# EAGLE design Relay_PCB_v1 (EAGLE 9.0.1)
Relay1
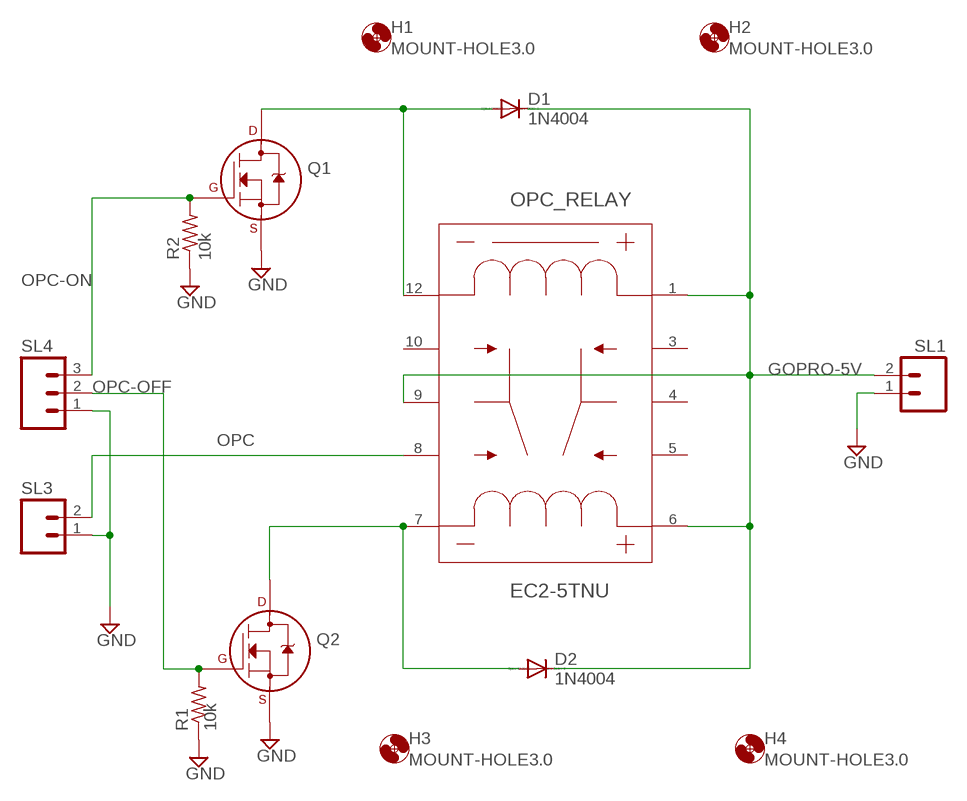
[diagram p0: schematic, sheet 1]

## Parts
D1  1N4004  [DO41-10]
D2  1N4004  [DO41-10]
H1  MOUNT-HOLE3.0  [3,0]
H2  MOUNT-HOLE3.0  [3,0]
H3  MOUNT-HOLE3.0  [3,0]
H4  MOUNT-HOLE3.0  [3,0]
OPC_RELAY  EC2-5TNU  [EC2TNU]
Q1  2N7000_TO92  [TO-92]
Q2  2N7000_TO92  [TO-92]
R1  R-US_0207/7  [0207/7]
R2  R-US_0207/7  [0207/7]
SL1  M02  [02P]
SL3  M02  [02P]
SL4  M03  [03P]

## Nets
GND: Q1.1(S) Q2.1(S) R1.1 R2.1 SL1.1 SL3.1 SL4.1
GOPRO-5V: D1.C D2.C OPC_RELAY.1 OPC_RELAY.6 OPC_RELAY.9 SL1.2
N$1: D1.A OPC_RELAY.12 Q1.3(D)
N$3: D2.A OPC_RELAY.7 Q2.3(D)
OPC: OPC_RELAY.8 SL3.2
OPC-OFF: Q2.2(G) R1.2 SL4.2
OPC-ON: Q1.2(G) R2.2 SL4.3
Unconnected: OPC_RELAY.3 OPC_RELAY.4 OPC_RELAY.5 OPC_RELAY.10

## Notes on the sheet
- 10k
- 10k

## Library data of the parts
D1 D2 = diode:1N4004: DIODE general purpose rectifier, 1 A
H1-H4 = holes:MOUNT-HOLE: MOUNTING HOLE with drill center marker
OPC_RELAY = EC2-5TNU:EC2-5TNU; MANUFACTURER_PART_NUMBER: EC25TNU; VENDOR: KEMET
Q1 Q2 = transistors:2N700*: 2N7000, 2N7002, NDS7002A N-channel enhancement mode MOSFET
R1 R2 = rcl:R-US_: RESISTOR, American symbol; SPICEPREFIX: R
SL1 SL3 = con-amp-quick:M02: AMP QUICK CONNECTOR; OC_FARNELL: unknown; OC_NEWARK: unknown
SL4 = con-amp-quick:M03: AMP QUICK CONNECTOR; OC_FARNELL: unknown; OC_NEWARK: unknown

## Board
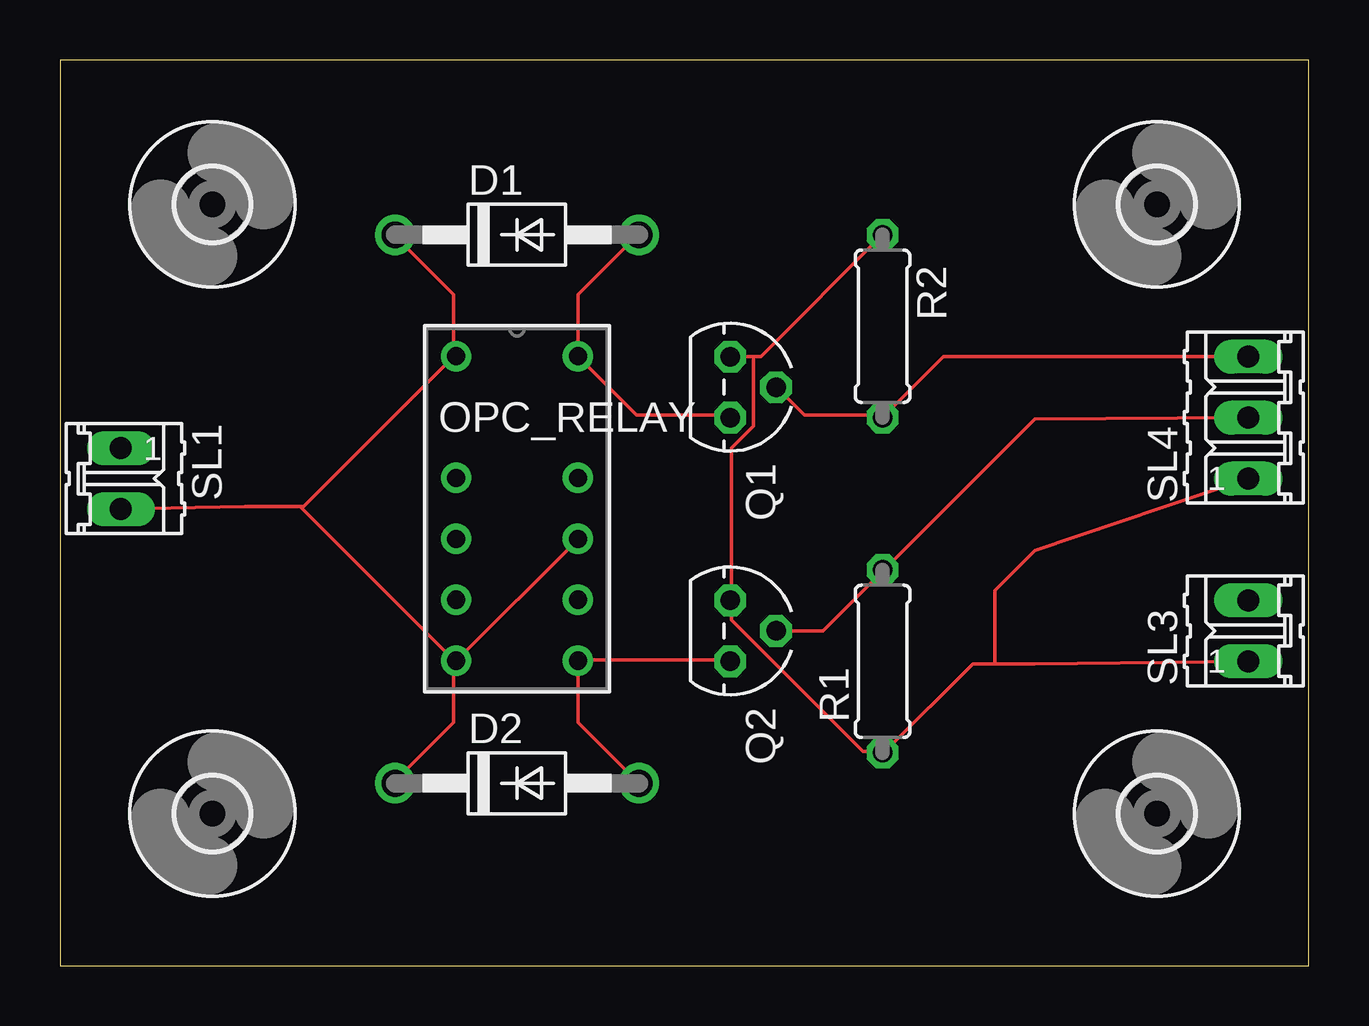
[diagram p1: board, top side]
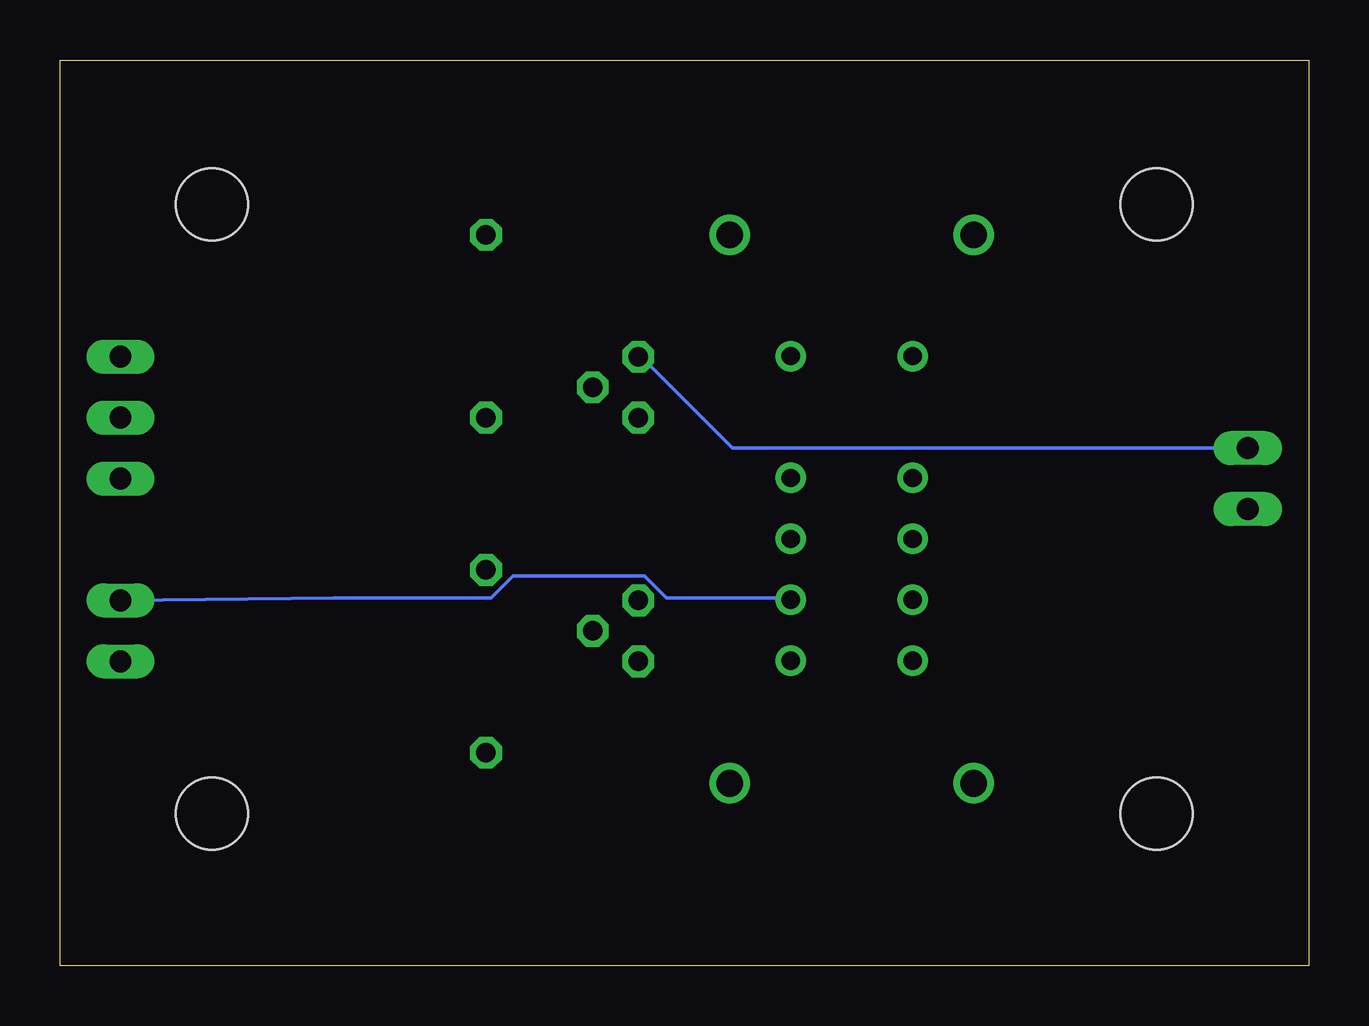
[diagram p2: board, bottom side, seen from below]

Size 52.05 x 37.77 mm. Coordinates in mm from the lower left corner, seen from the top.
Outline: 0,0 52.05,0 52.05,37.77 0,37.77 0,0
Copper layers (1*16): Top 0.035mm / dielectric 1.5mm / Bottom 0.035mm
Design rules "default": minimum track width 6mil, minimum drill 0.35mm, track to track 6mil, track to pad 6mil, pad to pad 6mil, via to via 6mil, smd to smd 6mil, copper to edge 40mil, drill to drill 6mil, minimum pad ring 10mil, minimum via ring 8mil, stop-mask expansion 4mil, vias tented up to drill 0mil, thermal gap 10mil

### Footprints (pad centres in the part's own frame; a part is rotated, then mirrored left to right if it is on the bottom)
DO41-10 = drill 1.118: A 5.08,0; C -5.08,0
3,0 = hole 3: 0,0
EC2TNU = drill 0.762 pad 1.27: 1 -2.54,6.375; 3 -2.54,1.295; 4 -2.54,-1.245; 5 -2.54,-3.785; 6 -2.54,-6.325; 7 2.54,-6.325; 8 2.54,-3.785; 9 2.54,-1.245; 10 2.54,1.295; 12 2.54,6.375
TO-92 = drill 0.813 octagon: 1 -1.27,0; 2 0,1.905; 3 1.27,0
0207/7 = drill 0.813 octagon: 1 -3.81,0; 2 3.81,0
02P = drill 0.914 long: 1 -1.27,0; 2 1.27,0
03P = drill 0.914 long: 1 -2.54,0; 2 0,0; 3 2.54,0

### Placement (x,y rotation side)
D1  19.05,30.48 0 top
D2  19.05,7.62 0 top
H1  6.35,31.75 0 top
H2  45.72,31.75 0 top
H3  6.35,6.35 0 top
H4  45.72,6.35 0 top
OPC_RELAY  19.05,19.05 0 top
Q1  27.94,24.13 270 top
Q2  27.94,13.97 270 top
R1  34.29,12.7 90 top
R2  34.29,26.67 270 top
SL1  2.54,20.32 270 top
SL3  49.53,13.97 90 top
SL4  49.53,22.86 90 top

### Tracks (layer width: path | path; a pad name or v marks a point on that pad's centre or on a via)
GND
  Top 0.152: 38.96,12.6 38.05,12.6 34.39,8.94 R1.1 34.24,8.94 33.48,8.94 27.99,14.43 27.99,15.19 Q2.1 27.99,15.34 27.99,21.59 28.9,22.5 28.9,25.4 | 38.96,12.6 40.64,12.6 SL3.1 | SL4.1 40.64,17.32 38.96,15.65 38.96,12.6 | 28.9,25.4 29.21,25.4 R2.1 | 28.9,25.4 Q1.1
  Bottom 0.152: SL1.1 24.03,21.59 27.84,25.4 Q1.1
GOPRO-5V
  Top 0.152: OPC_RELAY.6 16.41,12.6 16.41,10.16 13.97,7.72 D2.C | OPC_RELAY.9 21.59,17.78 16.56,12.75 OPC_RELAY.6 | D1.C 13.97,30.43 16.41,27.99 16.41,25.55 OPC_RELAY.1 16.41,25.4 10.16,19.15 10.01,19.15 | 10.01,19.15 7.72,19.15 SL1.2 | 10.01,19.15 16.41,12.75 OPC_RELAY.6
N$1
  Top 0.152: D1.A 24.03,30.43 21.59,27.99 OPC_RELAY.12 21.59,25.4 24.03,22.96 27.84,22.96 Q1.3
N$3
  Top 0.152: D2.A 21.59,10.16 OPC_RELAY.7 21.59,12.75 27.84,12.75 Q2.3
OPC
  Bottom 0.152: OPC_RELAY.8 21.59,15.34 26.77,15.34 27.69,16.26 33.17,16.26 34.09,15.34 40.64,15.34 SL3.2
OPC-OFF
  Top 0.152: Q2.2 31.8,13.97 34.24,16.41 R1.2 34.39,16.56 40.64,22.81 SL4.2
OPC-ON
  Top 0.152: Q1.2 29.97,24.03 31.04,22.96 34.24,22.96 R2.2 36.83,25.4 SL4.3